# EAGLE design BLE_Mate2 (EAGLE 6.5.0)
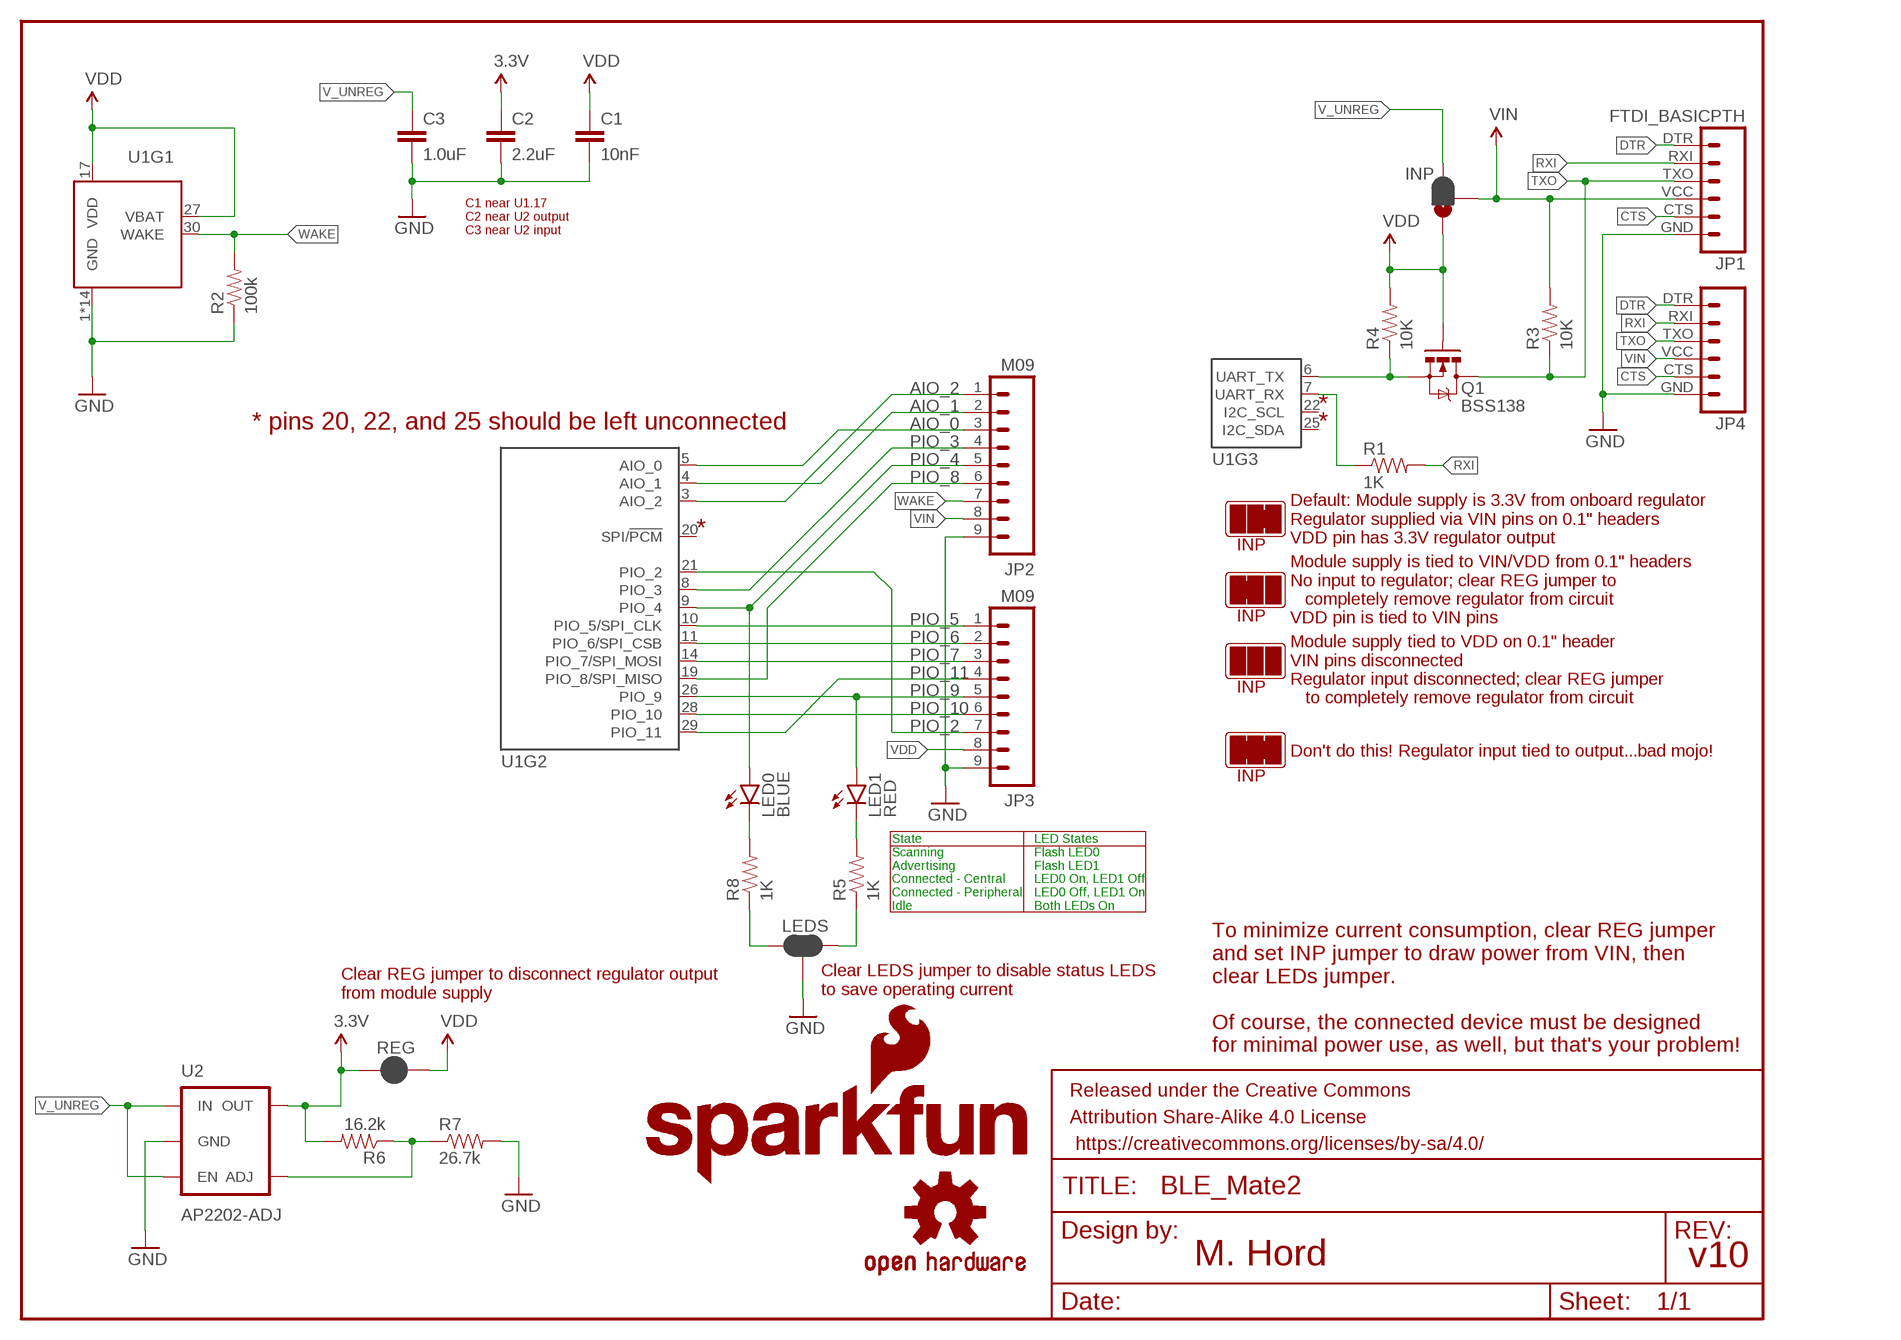
[diagram p0: schematic, sheet 1]

## Parts
C1  10nF  10NF/10000PF-50V-10%(0603)  [0603-CAP]
C2  2.2uF  2.2UF-10V-20%(0603)  [0603-CAP]
C3  1.0uF  1.0UF-16V-10%(0603)  [0603-CAP]
FRAME1  FRAME-LETTER  [CREATIVE_COMMONS]
INP  JUMPER-PAD-3-2OF3_NC_BY_PASTE  [PAD-JUMPER-3-2OF3_NC_BY_PASTE_YES_SILK_FULL_BOX]
JP1  FTDI_BASICPTH  [FTDI_BASIC]
JP2  M09  [1X09]
JP3  M09  [1X09]
JP4  M06SIP  [1X06]
LED0  BLUE  LED-BLUE0603  [LED-0603]
LED1  RED  LED-RED0603  [LED-0603]
LEDS  JUMPER-PAD-3-NC_BY_PASTE  [PAD-JUMPER-3-NC_BY_PASTE_YES_SILK_FULL_BOX]
LOGO1  SFE_LOGO_NAME.1_INCH  [SFE_LOGO_NAME_.1]
LOGO2  OSHW-LOGOS  [OSHW-LOGO-S]
LOGO3  SFE_LOGO_NAME_FLAME.1_INCH  [SFE_LOGO_NAME_FLAME_.1]
LOGO4  OSHW-LOGOS  [OSHW-LOGO-S]
Q1  BSS138  MOSFET-NCHANNELBSS138  [SOT23]
R1  1K  1KOHM1/10W1%(0603)  [0603-RES]
R2  100k  100KOHM1/10W1%(0603)  [0603-RES]
R3  10K  10KOHM1/10W1%(0603)0603  [0603-RES]
R4  10K  10KOHM1/10W1%(0603)0603  [0603-RES]
R5  1K  1KOHM1/10W1%(0603)  [0603-RES]
R6  16.2k  16.2KOHM1/10W1%(0603)  [0603-RES]
R7  26.7k  16.2KOHM1/10W1%(0603)  [0603-RES]
R8  1K  1KOHM1/10W1%(0603)  [0603-RES]
REG  JUMPER-PAD-2-NC_BY_PASTE  [PAD-JUMPER-2-NC_BY_PASTE_YES_SILK]
U1  BC118  [BC118]
U2  AP2202-ADJ  [SOT23-5]

## Nets
3.3V: C2.1 R6.2 REG.1 U2.5(OUT)
AIO_0: JP2.3 U1.5(AIO_0)
AIO_1: JP2.2 U1.4(AIO_1)
AIO_2: JP2.1 U1.3(AIO_2)
CTS: JP1.CTS JP4.CTS
DTR: JP1.DTR JP4.DTR
GND: C1.2 C2.2 C3.2 JP1.GND JP2.9 JP3.9 JP4.GND LEDS.2 R2.1 R7.2 U1.1(GND) U1.2(GND) U1.12(GND) U1.13(GND) U1.15(GND) U1.16(GND) U1.18(GND) U1.23(GND) U1.24(GND) U1.31(GND) U1.32(GND) U1.33(GND) U1.34(GND) U1.35(GND) U2.2(GND)
N$2: R1.1 U1.7(UART_RX)
N$3: R6.1 R7.1 U2.4(ADJ)
N$4: Q1.2(S) R4.1 U1.6(UART_TX)
N$5: LEDS.1 R8.1
N$6: LEDS.3 R5.1
N$8: LED0.C R8.2
N$9: LED1.C R5.2
PIO_2: JP3.7 U1.21(PIO_2)
PIO_3: JP2.4 U1.8(PIO_3)
PIO_4: JP2.5 LED0.A U1.9(PIO_4)
PIO_5: JP3.1 U1.10(PIO_5/SPI_CLK)
PIO_6: JP3.2 U1.11(PIO_6/SPI_CSB)
PIO_7: JP3.3 U1.14(PIO_7/SPI_MOSI)
PIO_8: JP2.6 U1.19(PIO_8/SPI_MISO)
PIO_9: JP3.5 LED1.A U1.26(PIO_9)
PIO_10: JP3.6 U1.28(PIO_10)
PIO_11: JP3.4 U1.29(PIO_11)
RXI: JP1.RXI JP4.RXI R1.2
TXO: JP1.TXO JP4.TXO Q1.3(D) R3.1
V_UNREG: C3.1 INP.3 U2.1(IN) U2.3(EN)
VDD: C1.1 INP.1 JP3.8 Q1.1(G) R4.2 REG.2 U1.17(VDD) U1.27(VBAT)
VIN: INP.2 JP1.VCC JP2.8 JP4.VCC R3.2
WAKE: JP2.7 R2.2 U1.30(WAKE)
Unconnected: U1.20(SPI/!PCM) U1.22(I2C_SCL) U1.25(I2C_SDA)

## Notes on the sheet
- C1 near U1.17
  C2 near U2 output
  C3 near U2 input
- *
- * pins 20, 22, and 25 should be left unconnected | *
- *
- Default: Module supply is 3.3V from onboard regulator
  Regulator supplied via VIN pins on 0.1" headers
  VDD pin has 3.3V regulator output
- INP
- INP
- Module supply is tied to VIN/VDD from 0.1" headers
  No input to regulator; clear REG jumper to 
     completely remove regulator from circuit
  VDD pin is tied to VIN pins
- INP
- Module supply tied to VDD on 0.1" header
  VIN pins disconnected
  Regulator input disconnected; clear REG jumper
     to completely remove regulator from circuit
- Don't do this! Regulator input tied to output...bad mojo!
- INP
- State
  Scanning
  Advertising
  Connected - Central
  Connected - Peripheral
  Idle
- LED States
  Flash LED0
  Flash LED1
  LED0 On, LED1 Off
  LED0 Off, LED1 On
  Both LEDs On
- Clear LEDS jumper to disable status LEDS
  to save operating current
- Clear REG jumper to disconnect regulator output
  from module supply
- To minimize current consumption, clear REG jumper
  and set INP jumper to draw power from VIN, then
  clear LEDs jumper.
  
  Of course, the connected device must be designed
  for minimal power use, as well, but that's your problem!
- M. Hord | v10

## Library data of the parts
C1 = SparkFun-Capacitors:10NF/10000PF-50V-10%(0603): CAP-00867; PROD_ID: CAP-00867
C2 = SparkFun-Capacitors:2.2UF-10V-20%(0603): CAP-07888; PROD_ID: CAP-07888
C3 = SparkFun-Capacitors:1.0UF-16V-10%(0603): CAP-00868; PROD_ID: CAP-00868
FRAME1 = SparkFun-Aesthetics:FRAME-LETTER: Schematic Frame Standard 8.5x11 US Letter frame
INP = SparkFun-Passives:JUMPER-PAD-3-2OF3_NC_BY_PASTE
JP1 = SparkFun-Connectors:FTDI_BASIC: FTDI Basic header with labels
JP2 JP3 = SparkFun-Connectors:M09: Header 9 Standard 9-pin 0.1" header. Use with straight break away headers (SKU : PRT-00116), right angle break away headers (PRT-00553), swiss pins (PRT-00743), machine pins (PRT-00117), and female headers (PRT-00115).
JP4 = SparkFun-Connectors:M06: Header 6 Standard 6-pin 0.1" header. Use with straight break away headers (SKU : PRT-00116), right angle break away headers (PRT-00553), swiss pins (PRT-00743), machine pins (PRT-00117), and female headers (PRT-00115). Molex polarized connector foot print use with SKU : PRT-08094 with associated crimp pins and housings. NOTES ON THE VARIANTS LOCK and LOCK_LONGPADS... This footprint was designed to help hold the alignment of a through-hole component (i.e. 6-pin header) while soldering it into place. You may notice that each hole has been shifted either up or down by 0.005 of an inch from it's more standard position (which is a perfectly straight line). This slight alteration caused the pins (the squares in the middle) to touch the edges of the holes. Because they are alternating, it causes a "brace" to hold the component in place. 0.005 has proven to be the perfect amount of "off-center" position when using our standard breakaway headers. Although looks a little odd when you look at the bare footprint, once you have a header in there, the alteration is very hard to notice. Also,if you push a header all the way into place, it is covered up entirely on the bottom side. This idea of altering the position of holes to aid alignment will be further integrated into the Sparkfun Library for other footprints. It can help hold any component with 3 or more connection pins.
LED0 = SparkFun-LED:LED-BLUE: Blue LEDs for production use Various blue LEDs stocked by SparkFun production 0603 - DIO-08575 Rebel - DIO-09553 1206 - DIO-09911; PROD_ID: DIO-08575
LED1 = SparkFun-LED:LED-RED: Assorted Red LEDs LilyPad 1206- DIO-09912 1206- DIO-00809 0603- DIO-00819; PROD_ID: DIO-00819
LEDS = SparkFun-Passives:JUMPER-PAD-3-NC_BY_PASTE
LOGO1 = SparkFun-Aesthetics:SFE_LOGO_NAME: SFE Logo, name only This is the SparkFun name logo. The logo on the schematic will always be the same size; the package variant is the height of the flame part of the logo (or the height the flame would be, if it were drawn). Default layer for the logo on the board is tSilk.
LOGO2 LOGO4 = SparkFun-Aesthetics:OSHW-LOGO: Open Source Hardware Logo This logo indicates the piece of hardware it is found on incorporates a OSHW license and/or adheres to the definition of open source hardware found here: http://freedomdefined.org/OSHW
LOGO3 = SparkFun-Aesthetics:SFE_LOGO_NAME_FLAME: SFE Logo, name and flame This is the SparkFun full logo. The logo on the schematic will always be the same size; the package variant is the height of the flame part of the logo. Default layer for the logo on the board is tSilk.
Q1 = SparkFun-DiscreteSemi:MOSFET-NCHANNEL: Common NMOSFET Parts MFG P/N Store ID Prod ID FDD8780 TRANS-09984 SI7820DN TRANS-11055 FDS6630A IC-08089 2N7002PW TRANS-11151 FQP30N06L COM-10213 TRANS-10060 BSS123LT1G TRANS-08345 BSS138 TRANS-00830 BS170 2N7000; PROD_ID: TRANS-00830
R1 R5 R8 = SparkFun-Resistors:1KOHM1/10W1%(0603): RES-07856; PROD_ID: RES-07856
R2 = SparkFun-Resistors:100KOHM1/10W1%(0603): RES-07828; PROD_ID: RES-07828
R3 R4 = SparkFun-Resistors:10KOHM1/10W1%(0603): RES-00824; PROD_ID: RES-00824
R6 = SparkFun-Resistors:16.2KOHM1/10W1%(0603); PROD_ID: RES-12187
R7 = SparkFun-Resistors:16.2KOHM1/10W1%(0603); PROD_ID: RES-12187; VALUE: 16.2k
REG = SparkFun-Passives:JUMPER-PAD-2-NC_BY_PASTE
U1 = SparkFun-RF:BC118; PROD_ID: WRL-12203; VALUE: BC118
U2 = SparkFun-PowerIC:AP2202-ADJ: AP2202 Adjustable LDO Diodes Inc small, low-cost LDO 150mA, 13.2V, less than 200mV dropout; PROD_ID: VREG-12189

## Board
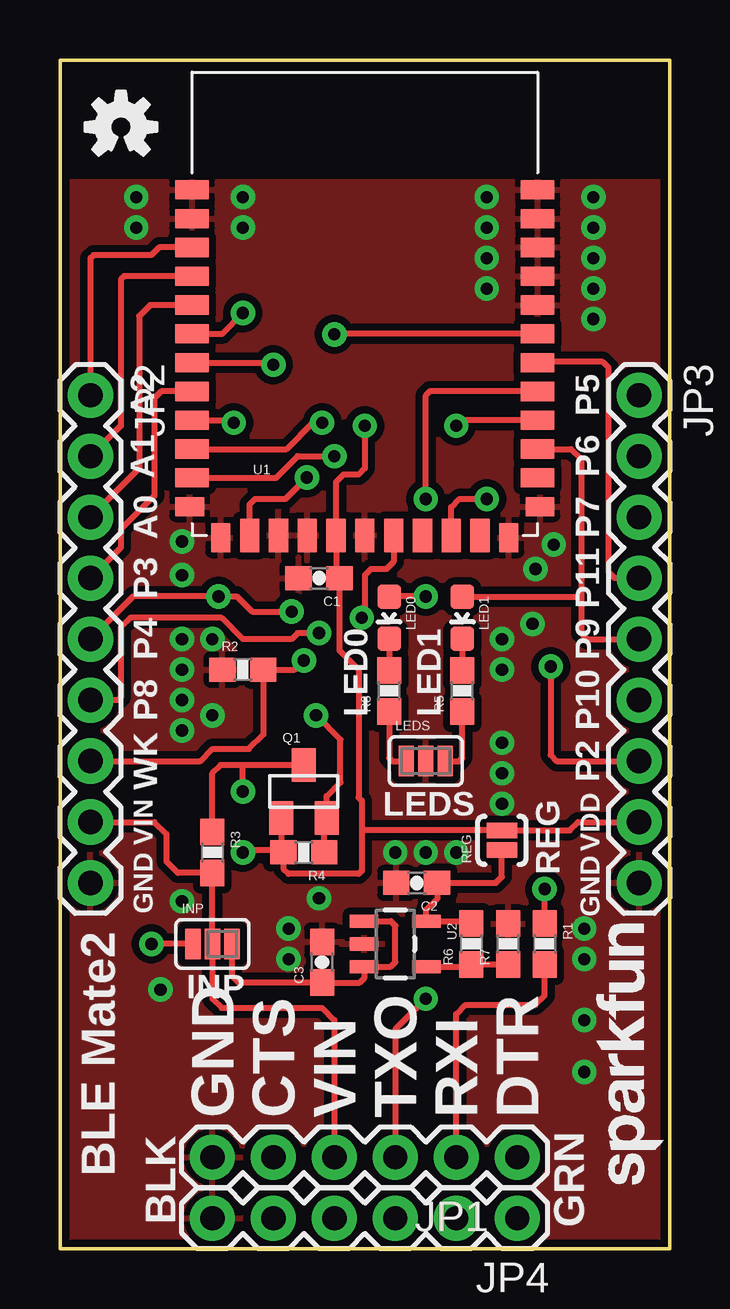
[diagram p1: board, top side]
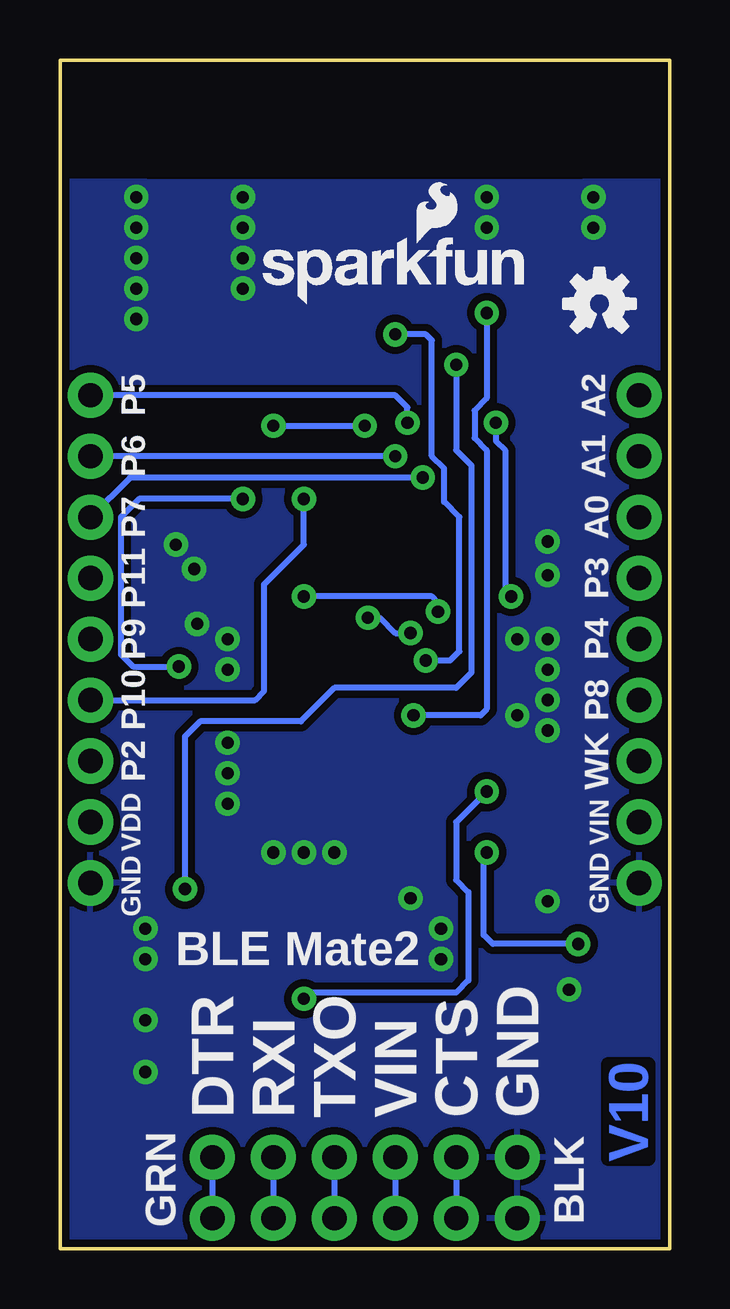
[diagram p2: board, bottom side, seen from below]

Size 25.4 x 49.53 mm. Coordinates in mm from the lower left corner, seen from the top.
Outline: 0,49.53 25.4,49.53 25.4,0 0,0 0,49.53
Copper layers (1*16): Top 0.035mm / dielectric 1.5mm / Bottom 0.035mm
Design rules "Sparkfun *": minimum track width 8mil, minimum drill 20mil, track to track 8mil, track to pad 8mil, pad to pad 8mil, via to via 8mil, smd to smd 8mil, copper to edge 8mil, drill to drill 8mil, minimum pad ring 12mil, minimum via ring 10mil, stop-mask expansion 4mil, vias tented up to drill 20mil, thermal gap 10mil

### Footprints (pad centres in the part's own frame; a part is rotated, then mirrored left to right if it is on the bottom)
0603-CAP = smd 1.1 x 1: 1 -0.85,0; 2 0.85,0
PAD-JUMPER-3-2OF3_NC_BY_PASTE_YES_SILK_FULL_BOX = smd 0.635 x 1.27: 1 -0.813,0; 2 0,0; 3 0.813,0
FTDI_BASIC = drill 1.016 pad 1.88: CTS 10.16,0; DTR 0,0; GND 12.7,0; RXI 2.54,0; TXO 5.08,0; VCC 7.62,0
1X09 = drill 1.016 pad 1.88: 1 0,0; 2 2.54,0; 3 5.08,0; 4 7.62,0; 5 10.16,0; 6 12.7,0; 7 15.24,0; 8 17.78,0; 9 20.32,0
1X06 = drill 1.016 pad 1.88: CTS 10.16,0; DTR 0,0; GND 12.7,0; RXI 2.54,0; TXO 5.08,0; VCC 7.62,0
LED-0603 = smd 1 x 1: A 0,-0.877; C 0,0.877
PAD-JUMPER-3-NC_BY_PASTE_YES_SILK_FULL_BOX = smd 0.635 x 1.27: 1 -0.813,0; 2 0,0; 3 0.813,0
SOT23 = smd 1 x 1.4: 1 -0.95,-1.1; 2 0.95,-1.1; 3 0,1.1
0603-RES = smd 1.1 x 1: 1 -0.85,0; 2 0.85,0
PAD-JUMPER-2-NC_BY_PASTE_YES_SILK = smd 0.635 x 1.27: 1 -0.401,0; 2 0.413,0
BC118 = smd 1.4 x 0.8: 1 -7.2,4.75; 2 -7.2,3.55; 3 -7.2,2.35; 4 -7.2,1.15; 5 -7.2,-0.05; 6 -7.2,-1.25; 7 -7.2,-2.45; 8 -7.2,-3.65; 9 -7.2,-4.85; 10 -7.2,-6.05; 11 -7.2,-7.25; 25 7.2,-7.25; 26 7.2,-6.05; 27 7.2,-4.85; 28 7.2,-3.65; 29 7.2,-2.45; 30 7.2,-1.25; 31 7.2,-0.05; 32 7.2,1.15; 33 7.2,2.35; 34 7.2,3.55; 35 7.2,4.75 | smd 1.2 x 0.8: 12 -7.3,-8.45; 24 7.3,-8.45 | smd 0.8 x 1.2: 13 -6,-9.75; 23 6,-9.75 | smd 0.8 x 1.4: 14 -4.8,-9.65; 15 -3.6,-9.65; 16 -2.4,-9.65; 17 -1.2,-9.65; 18 0,-9.65; 19 1.2,-9.65; 20 2.4,-9.65; 21 3.6,-9.65; 22 4.8,-9.65
SOT23-5 = smd 0.55 x 1.2: 1 -0.95,-1.3; 2 0,-1.3; 3 0.95,-1.3; 4 0.95,1.3; 5 -0.95,1.3

### Placement (x,y rotation side)
C1  10.79,27.94 180 top
C2  14.86,15.24 180 top
C3  10.92,11.94 90 top
FRAME1  -72.39,30.48 0 top  (outside the outline)
INP  6.35,12.7 0 top
JP1  19.05,3.81 180 top
JP2  1.27,35.56 270 top
JP3  24.13,35.56 270 top
JP4  19.05,1.27 180 top
LED0  13.72,26.29 180 top
LED1  16.76,26.29 180 top
LEDS  15.24,20.32 0 top
LOGO1  25.65,2.16 90 top
LOGO2  2.54,46.74 0 top
LOGO3  17.4,39.24 0 bottom
LOGO4  2.92,39.37 0 bottom
Q1  10.16,19.05 0 top
R1  20.19,12.7 270 top
R2  7.62,24.13 0 top
R3  6.35,16.51 270 top
R4  10.16,16.51 180 top
R5  16.76,23.24 90 top
R6  17.14,12.7 90 top
R7  18.67,12.7 90 top
R8  13.72,23.24 90 top
REG  18.41,17.02 90 top
U1  12.7,39.37 0 top
U2  13.97,12.7 270 top

### Tracks (layer width: path | path; a pad name or v marks a point on that pad's centre or on a via)
3.3V
  Top 0.254: R6.2 17.05,13.65 U2.5 15.27,14.13 15.71,14.57 C2.1 18.16,15.24 18.41,15.49 REG.1
AIO_0
  Top 0.254: U1.5 3.76,39.32 3.3,38.86 3.3,32.51 JP2.3
AIO_1
  Top 0.254: U1.4 2.67,40.52 2.54,40.39 2.54,34.29 JP2.2
AIO_2
  Top 0.254: U1.3 4.13,41.72 3.81,41.4 1.4,41.4 1.27,41.27 JP2.1
CTS
  Bottom 0.254: JP1.CTS JP4.CTS
DTR
  Bottom 0.254: JP1.DTR JP4.DTR
GND  (via drill 0.51)
  other vias: 5.08,28.07 5.08,29.46 6.35,22.23 5.08,25.4 6.35,25.4 5.08,24.13 5.08,21.59 5.08,22.86 13.97,16.51 15.24,16.51 16.51,16.51 10.79,14.61 9.53,13.34 9.53,12.06 21.84,13.34 21.84,12.06 21.84,9.52 21.84,7.37 18.41,21.08 18.41,19.81 18.41,18.54 18.41,24.13 18.41,25.4 19.69,26.03 20.57,29.34 19.81,28.32 22.23,38.73 22.23,40.01 22.23,41.27 22.23,42.55 22.23,43.82 17.78,43.82 17.78,42.55 17.78,41.27 17.78,40.01 7.62,43.82 7.62,42.55 3.17,43.82 3.17,42.55 5.08,14.48 4.19,10.79
  pour Top (isolate 0.305): 0,44.45 25.4,44.45 25.4,0 0,0
  pour Bottom (isolate 0.305): 0,44.45 25.4,44.45 25.4,0 0,0
N$2  (via drill 0.51)
  Top 0.254: U1.7 8.8,36.92 v8.89,36.83 | R1.1 v20.19,14.99
  Bottom 0.254: v8.89,36.83 8.89,33.27 8.25,32.64 8.25,24 8.89,23.37 13.97,23.37 15.37,21.97 19.56,21.97 20.19,21.34 v20.19,14.99
N$3
  Top 0.254: U2.4 17.05,11.75 R6.1 R7.1
N$4  (via drill 0.51)
  Top 0.254: R4.1 11.01,17.85 Q1.2 11.11,18.86 11.68,19.43 11.68,21.21 v10.67,22.23 | U1.6 6.75,38.12 v7.62,38.99
  Bottom 0.254: v7.62,38.99 7.62,35.43 8.13,34.92 8.13,33.78 7.62,33.27 7.62,22.48 7.87,22.23 v10.67,22.23
N$5
  Top 0.254: R8.1 13.72,20.45 13.84,20.32 LEDS.1
N$6
  Top 0.254: LEDS.3 16.64,20.32 16.76,20.45 R5.1
N$8
  Top 0.254: LED0.C R8.2
N$9
  Top 0.254: LED1.C R5.2
PIO_2  (via drill 0.51)
  Top 0.254: U1.21 16.3,30.91 16.64,31.24 v17.78,31.24 | v20.45,24.26 20.45,20.57 20.7,20.32 JP3.7
  Bottom 0.254: v17.78,31.24 22.1,31.24 22.86,30.48 22.86,24.77 22.35,24.26 v20.45,24.26
PIO_3
  Top 0.254: U1.8 4.22,35.72 3.94,35.43 3.94,31.37 2.54,29.97 2.54,29.21 JP2.4
PIO_4  (via drill 0.51)
  Top 0.254: JP2.5 3.05,27.18 v6.6,27.18 7.37,27.18 8,26.54 v9.65,26.54 | U1.9 7.14,34.52 v7.24,34.42 | v15.24,27.18 LED0.A
  Bottom 0.254: v7.24,34.42 7.24,33.66 6.86,33.27 6.86,27.43 v6.6,27.18 | v9.65,26.54 9.65,26.92 9.91,27.18 v15.24,27.18
PIO_5  (via drill 0.51)
  Top 0.254: U1.10 9.44,33.32 10.54,34.42 v10.92,34.42
  Bottom 0.254: v10.92,34.42 10.92,35.05 11.43,35.56 JP3.1
PIO_6  (via drill 0.51)
  Top 0.254: U1.11 9.01,32.12 9.91,33.02 v11.43,33.02
  Bottom 0.254: v11.43,33.02 JP3.2
PIO_7  (via drill 0.51)
  Top 0.254: U1.14 7.9,31.01 8.13,31.24 9.4,31.24 v10.29,32.13
  Bottom 0.254: v10.29,32.13 22.48,32.13 JP3.3
PIO_8  (via drill 0.51)
  Top 0.254: U1.19 13.9,28.63 13.59,28.32 12.95,28.32 12.7,28.07 12.7,26.42 v12.57,26.29 | v10.79,25.65 9.91,25.65 9.65,25.4 7.62,25.4 6.73,26.29 2.92,26.29 2.54,25.91 2.54,22.99 2.41,22.86 JP2.6
  Bottom 0.254: v12.57,26.29 12.07,26.29 11.43,25.65 v10.79,25.65
PIO_9
  Top 0.254: LED1.A 21.7,27.17 21.72,27.18 | 21.72,27.18 21.72,25.65 21.97,25.4 JP3.5 | U1.26 21.29,33.32 21.72,32.89 21.72,27.18
PIO_10  (via drill 0.51)
  Top 0.254: v15.24,31.24 15.24,35.56 15.4,35.72 U1.28
  Bottom 0.254: JP3.6 17.27,22.86 16.89,23.24 16.89,27.69 15.24,29.34 v15.24,31.24
PIO_11
  Top 0.254: JP3.4 23.11,27.94 22.86,28.19 22.86,36.7 22.61,36.96 19.94,36.96 U1.29
RXI
  Top 0.254: JP1.RXI 16.51,9.78 16.89,10.16 19.81,10.16 20.19,10.54 R1.2
  Bottom 0.254: JP1.RXI JP4.RXI
TXO  (via drill 0.51)
  Top 0.254: R3.1 6.35,19.81 6.69,20.15 7.62,20.15 | Q1.3 7.62,20.15 | v7.62,19.05 7.62,20.15 | v15.24,10.41 13.97,9.14 JP1.TXO
  Bottom 0.254: v7.62,19.05 8.89,17.78 8.89,15.37 8.38,14.86 8.38,11.18 8.89,10.67 14.99,10.67 v15.24,10.41 | JP1.TXO JP4.TXO
V_UNREG
  Top 0.254: U2.1 13.78,13.65 13.97,13.46 13.97,11.94 13.78,11.75 U2.3 12.67,11.27 12.48,11.09 C3.1 7.45,11.09 7.16,11.38 INP.3
VDD  (via drill 0.51)
  Top 0.254: JP3.8 21.59,17.78 21.24,17.43 REG.2 12.61,17.43 12.57,17.4 | Q1.1 9.21,16.61 | 9.21,16.61 R4.2 9.31,15.84 9.53,15.62 12.45,15.62 12.57,15.75 12.57,17.4 | INP.1 v3.81,12.7 | 9.21,16.61 7.72,16.61 v7.62,16.51 | 12.57,17.4 12.57,18.67 12.45,18.8 12.45,24.13 11.64,24.93 C1.1 11.5,28.09 U1.17 11.5,31.95 11.81,32.26 12.45,32.26 12.7,32.51 v12.7,34.29 | U1.27 16.74,34.52 v16.51,34.29
  Bottom 0.254: v3.81,12.7 7.37,12.7 7.75,13.08 7.75,16.38 v7.62,16.51 | v16.51,34.29 v12.7,34.29
VIN
  Top 0.254: JP2.8 3.94,17.78 4.45,17.27 4.45,16.13 4.91,15.66 R3.2 INP.2 6.35,10.41 6.73,10.03 10.92,10.03 11.43,9.52 JP1.VCC
  Bottom 0.254: JP1.VCC JP4.VCC
WAKE  (via drill 0.51)
  Top 0.254: JP2.7 5.84,20.32 6.35,20.83 7.87,20.83 8.47,21.42 R2.2 9.78,24.13 v10.16,24.51 | U1.30 11.45,38.12 v11.43,38.1
  Bottom 0.254: v10.16,24.51 9.14,24.51 8.76,24.89 8.76,30.48 9.4,31.12 9.4,32.51 9.91,33.02 9.91,37.85 10.16,38.1 v11.43,38.1

### Text on the board
Bottom: V10
tPlace: A2 | P5 | A1 | P6 | A0 | P7 | P3 | P11 | P4 | P9 | LED0 | LED1 | P8 | P10 | WK | P2 | LEDS | VIN | REG | VDD | GND | GND | INP | BLE Mate2 | GND | CTS | VIN | TXO | RXI | DTR | BLK | GRN
bPlace: A2 | P5 | A1 | P6 | A0 | P7 | P3 | P11 | P4 | P9 | P8 | P10 | WK | P2 | VIN | VDD | GND | GND | BLE Mate2 | GND | CTS | VIN | TXO | RXI | DTR | BLK | GRN
tDocu: Keep this area / clear of metal! | M. Hord